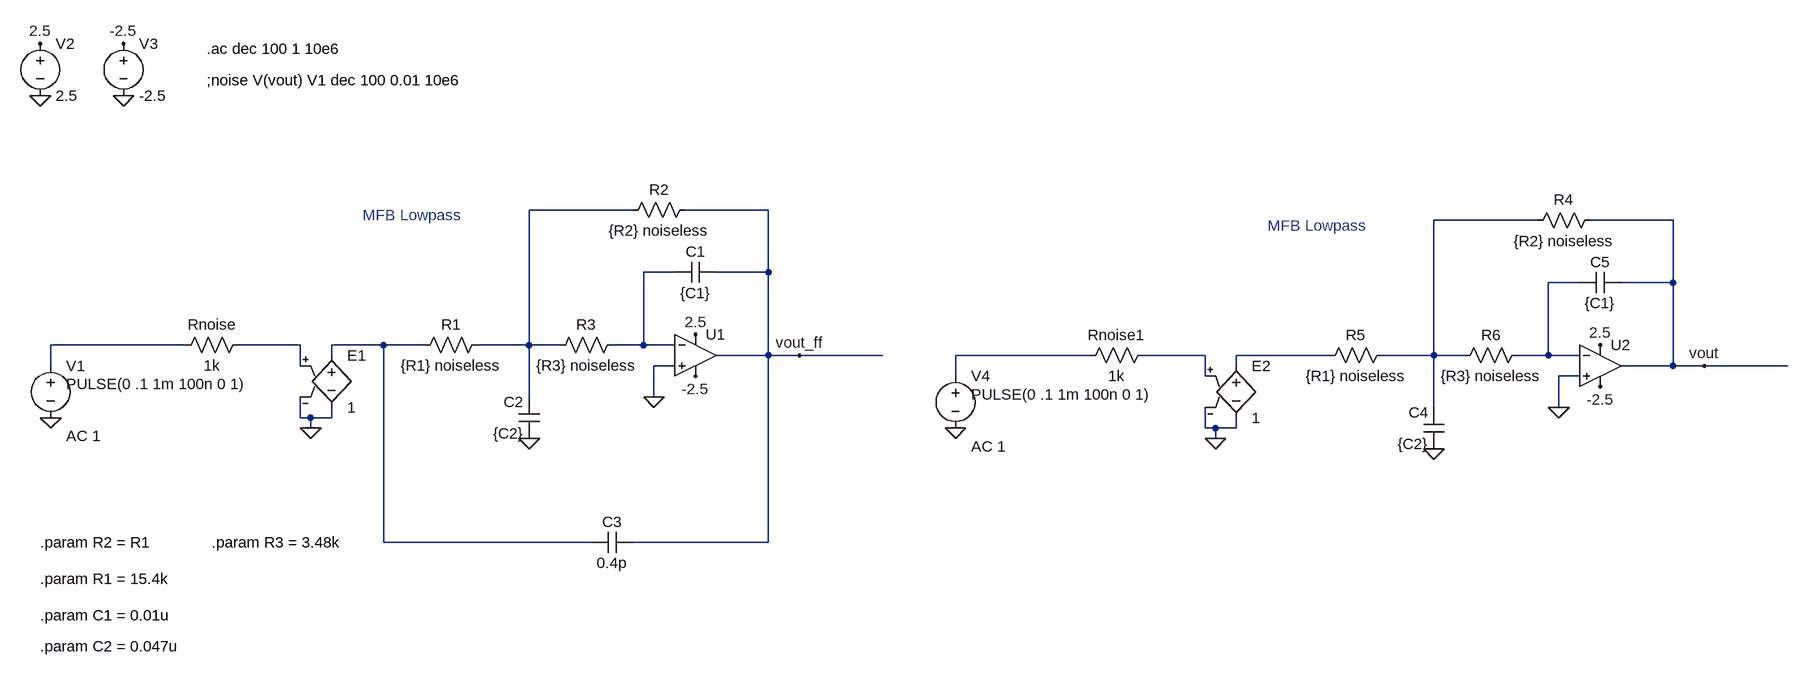
[diagram p0: schematic MFB_Butterworth.asc]
MFB_Butterworth.asc, the LTspice schematic file:
Version 4
SHEET 1 2244 856
WIRE 464 -64 304 -64
WIRE 672 -64 544 -64
WIRE 1856 -48 1696 -48
WIRE 2064 -48 1936 -48
WIRE 528 32 480 32
WIRE 672 32 672 -64
WIRE 672 32 592 32
WIRE 1920 48 1872 48
WIRE 2064 48 2064 -48
WIRE 2064 48 1984 48
WIRE -224 144 -432 144
WIRE -48 144 -144 144
WIRE 80 144 0 144
WIRE 144 144 80 144
WIRE 304 144 304 -64
WIRE 304 144 224 144
WIRE 352 144 304 144
WIRE 480 144 480 32
WIRE 480 144 432 144
WIRE 528 144 480 144
WIRE 0 160 0 144
WIRE 672 160 672 32
WIRE 672 160 592 160
WIRE 720 160 672 160
WIRE 848 160 720 160
WIRE 1168 160 960 160
WIRE 1344 160 1248 160
WIRE 1536 160 1392 160
WIRE 1696 160 1696 -48
WIRE 1696 160 1616 160
WIRE 1744 160 1696 160
WIRE 1872 160 1872 48
WIRE 1872 160 1824 160
WIRE 1920 160 1872 160
WIRE -432 176 -432 144
WIRE -48 176 -48 144
WIRE 528 176 496 176
WIRE 1392 176 1392 160
WIRE 2064 176 2064 48
WIRE 2064 176 1984 176
WIRE 2112 176 2064 176
WIRE 2240 176 2112 176
WIRE 960 192 960 160
WIRE 1344 192 1344 160
WIRE 1920 192 1888 192
WIRE 304 224 304 144
WIRE 496 224 496 176
WIRE 1696 240 1696 160
WIRE 1888 240 1888 192
WIRE -48 256 -48 224
WIRE -32 256 -48 256
WIRE 0 256 0 240
WIRE 0 256 -32 256
WIRE -32 272 -32 256
WIRE 1344 272 1344 240
WIRE 1360 272 1344 272
WIRE 1392 272 1392 256
WIRE 1392 272 1360 272
WIRE 1360 288 1360 272
WIRE 80 448 80 144
WIRE 400 448 80 448
WIRE 672 448 672 160
WIRE 672 448 464 448
FLAG 560 128 2.5
FLAG 560 192 -2.5
FLAG 304 288 0
FLAG -432 256 0
FLAG -448 -320 2.5
FLAG -320 -320 -2.5
FLAG -448 -240 0
FLAG -320 -240 0
FLAG -32 272 0
FLAG 720 160 vout_ff
FLAG 496 224 0
FLAG 1952 144 2.5
FLAG 1952 208 -2.5
FLAG 1696 304 0
FLAG 960 272 0
FLAG 1360 288 0
FLAG 2112 176 vout
FLAG 1888 240 0
SYMBOL Opamps\\UniversalOpamp2 560 160 R0
SYMATTR InstName U1
SYMATTR Value2 Avol=1Meg GBW=1Meg Slew=10Meg
SYMBOL res 560 -80 R90
WINDOW 0 0 56 VBottom 2
WINDOW 3 32 56 VTop 2
SYMATTR InstName R2
SYMATTR Value {R2} noiseless
SYMBOL res 240 128 R90
WINDOW 0 0 56 VBottom 2
WINDOW 3 32 56 VTop 2
SYMATTR InstName R1
SYMATTR Value {R1} noiseless
SYMBOL cap 320 288 R180
WINDOW 0 24 56 Left 2
WINDOW 3 24 8 Left 2
SYMATTR InstName C2
SYMATTR Value {C2}
SYMBOL cap 528 48 R270
WINDOW 0 32 32 VTop 2
WINDOW 3 0 32 VBottom 2
SYMATTR InstName C1
SYMATTR Value {C1}
SYMBOL voltage -432 160 R0
WINDOW 123 24 124 Left 2
WINDOW 39 0 0 Left 0
WINDOW 3 24 44 Left 2
SYMATTR Value2 AC 1
SYMATTR Value PULSE(0 .1 1m 100n 0 1)
SYMATTR InstName V1
SYMBOL voltage -448 -336 R0
WINDOW 123 0 0 Left 0
WINDOW 39 0 0 Left 0
SYMATTR InstName V2
SYMATTR Value 2.5
SYMBOL voltage -320 -336 R0
WINDOW 123 0 0 Left 0
WINDOW 39 0 0 Left 0
SYMATTR InstName V3
SYMATTR Value -2.5
SYMBOL e 0 144 R0
SYMATTR InstName E1
SYMATTR Value 1
SYMBOL res -128 128 R90
WINDOW 0 0 56 VBottom 2
WINDOW 3 32 56 VTop 2
SYMATTR InstName Rnoise
SYMATTR Value 1k
SYMBOL res 448 128 R90
WINDOW 0 0 56 VBottom 2
WINDOW 3 32 56 VTop 2
SYMATTR InstName R3
SYMATTR Value {R3} noiseless
SYMBOL cap 400 464 R270
WINDOW 0 32 32 VTop 2
WINDOW 3 0 32 VBottom 2
SYMATTR InstName C3
SYMATTR Value 0.4p
SYMBOL Opamps\\UniversalOpamp2 1952 176 R0
SYMATTR InstName U2
SYMATTR Value2 Avol=1Meg GBW=1Meg Slew=10Meg
SYMBOL res 1952 -64 R90
WINDOW 0 0 56 VBottom 2
WINDOW 3 32 56 VTop 2
SYMATTR InstName R4
SYMATTR Value {R2} noiseless
SYMBOL res 1632 144 R90
WINDOW 0 0 56 VBottom 2
WINDOW 3 32 56 VTop 2
SYMATTR InstName R5
SYMATTR Value {R1} noiseless
SYMBOL cap 1712 304 R180
WINDOW 0 24 56 Left 2
WINDOW 3 24 8 Left 2
SYMATTR InstName C4
SYMATTR Value {C2}
SYMBOL cap 1920 64 R270
WINDOW 0 32 32 VTop 2
WINDOW 3 0 32 VBottom 2
SYMATTR InstName C5
SYMATTR Value {C1}
SYMBOL voltage 960 176 R0
WINDOW 123 24 124 Left 2
WINDOW 39 0 0 Left 0
WINDOW 3 24 44 Left 2
SYMATTR Value2 AC 1
SYMATTR Value PULSE(0 .1 1m 100n 0 1)
SYMATTR InstName V4
SYMBOL e 1392 160 R0
SYMATTR InstName E2
SYMATTR Value 1
SYMBOL res 1264 144 R90
WINDOW 0 0 56 VBottom 2
WINDOW 3 32 56 VTop 2
SYMATTR InstName Rnoise1
SYMATTR Value 1k
SYMBOL res 1840 144 R90
WINDOW 0 0 56 VBottom 2
WINDOW 3 32 56 VTop 2
SYMATTR InstName R6
SYMATTR Value {R3} noiseless
TEXT 48 -56 Left 2 ;MFB Lowpass
TEXT -192 -312 Left 2 !.ac dec 100 1 10e6
TEXT -448 448 Left 2 !.param R2 = R1
TEXT -448 560 Left 2 !.param C1 = 0.01u
TEXT -448 608 Left 2 !.param C2 = 0.047u
TEXT -448 504 Left 2 !.param R1 = 15.4k
TEXT -192 -264 Left 2 !;noise V(vout) V1 dec 100 0.01 10e6
TEXT -184 448 Left 2 !.param R3 = 3.48k
TEXT 1440 -40 Left 2 ;MFB Lowpass

The netlist it stands for:
* MFB_Butterworth.asc
XU1 0 N003 2.5 -2.5 vout_ff level.2 Avol=1Meg GBW=1Meg Slew=10Meg ilimit=25m rail=0 Vos=0 phimargin=45 en=0 enk=0 in=0 ink=0 Rin=500Meg  ; pins IN+ IN- V+ V- OUT
R2 vout_ff N001 {R2} noiseless
R1 N001 N007 {R1} noiseless
C2 0 N001 {C2}
C1 N003 vout_ff {C1}
V1 N005 0 PULSE(0 .1 1m 100n 0 1) AC 1
V2 2.5 0 2.5
V3 -2.5 0 -2.5
E1 N007 0 N006 0 1
Rnoise N006 N005 1k
R3 N003 N001 {R3} noiseless
C3 N007 vout_ff 0.4p
XU2 0 N004 2.5 -2.5 vout level.2 Avol=1Meg GBW=1Meg Slew=10Meg ilimit=25m rail=0 Vos=0 phimargin=45 en=0 enk=0 in=0 ink=0 Rin=500Meg  ; pins IN+ IN- V+ V- OUT
R4 vout N002 {R2} noiseless
R5 N002 N010 {R1} noiseless
C4 0 N002 {C2}
C5 N004 vout {C1}
V4 N008 0 PULSE(0 .1 1m 100n 0 1) AC 1
E2 N010 0 N009 0 1
Rnoise1 N009 N008 1k
R6 N004 N002 {R3} noiseless
* MFB Lowpass
.ac dec 100 1 10e6
.param R2 = R1
.param C1 = 0.01u
.param C2 = 0.047u
.param R1 = 15.4k
;noise V(vout) V1 dec 100 0.01 10e6
.param R3 = 3.48k
* MFB Lowpass
.lib UniversalOpamps2.sub
.backanno
.end